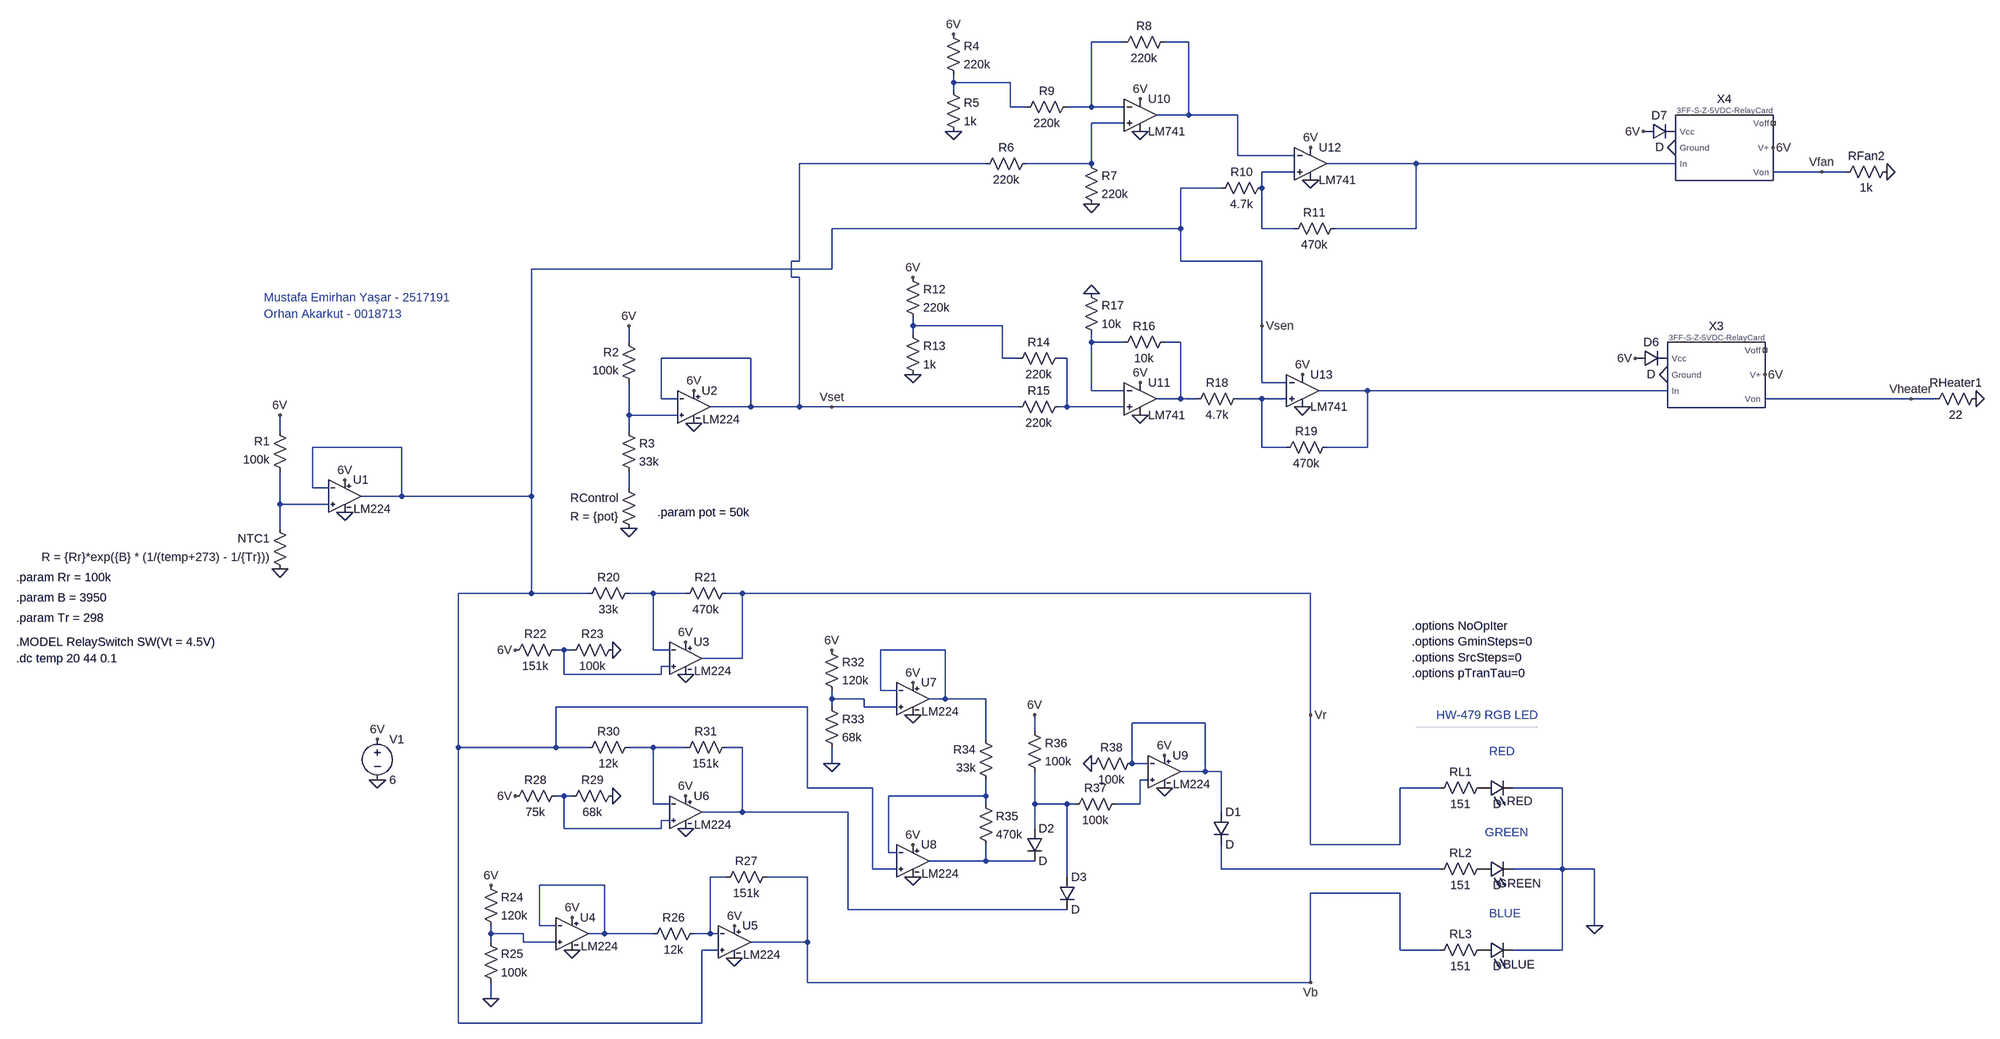
[diagram p0: schematic Completed_Circuit.asc]
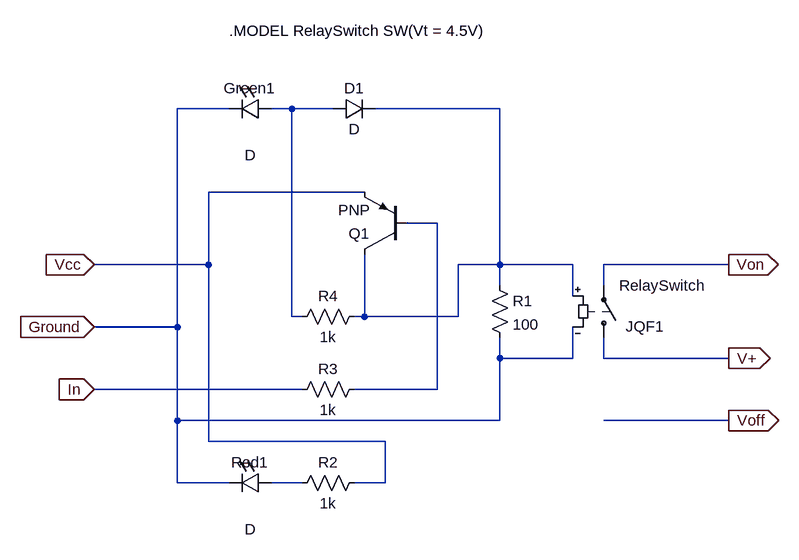
[diagram p1: sub-circuit 3ff-s-z-5vdc-relaycard.asc]
Completed_Circuit.asc, the LTspice schematic file:
Version 4
SHEET 1 2996 820
WIRE 1040 -1504 976 -1504
WIRE 1168 -1504 1120 -1504
WIRE 704 -1424 704 -1440
WIRE 816 -1424 704 -1424
WIRE 704 -1408 704 -1424
WIRE 816 -1376 816 -1424
WIRE 848 -1376 816 -1376
WIRE 976 -1376 976 -1504
WIRE 976 -1376 928 -1376
WIRE 1040 -1376 976 -1376
WIRE 1168 -1360 1168 -1504
WIRE 1168 -1360 1104 -1360
WIRE 1264 -1360 1168 -1360
WIRE 1040 -1344 976 -1344
WIRE 1264 -1280 1264 -1360
WIRE 1376 -1280 1264 -1280
WIRE 768 -1264 400 -1264
WIRE 976 -1264 976 -1344
WIRE 976 -1264 848 -1264
WIRE 1616 -1264 1440 -1264
WIRE 2128 -1264 1616 -1264
WIRE 1376 -1248 1312 -1248
WIRE 2416 -1248 2320 -1248
WIRE 2464 -1248 2416 -1248
WIRE 1232 -1216 1152 -1216
WIRE 1312 -1216 1312 -1248
WIRE 1152 -1136 1152 -1216
WIRE 1152 -1136 464 -1136
WIRE 1312 -1136 1312 -1216
WIRE 1376 -1136 1312 -1136
WIRE 1616 -1136 1616 -1264
WIRE 1616 -1136 1456 -1136
WIRE 400 -1072 400 -1264
WIRE 400 -1072 384 -1072
WIRE 1152 -1072 1152 -1136
WIRE 1312 -1072 1152 -1072
WIRE 464 -1056 464 -1136
WIRE 464 -1056 -128 -1056
WIRE 384 -1040 384 -1072
WIRE 400 -1040 384 -1040
WIRE 624 -944 624 -960
WIRE 800 -944 624 -944
WIRE 1312 -944 1312 -1072
WIRE 624 -928 624 -944
WIRE 64 -912 64 -944
WIRE 976 -912 976 -928
WIRE 1040 -912 976 -912
WIRE 1152 -912 1120 -912
WIRE 304 -880 128 -880
WIRE 800 -880 800 -944
WIRE 832 -880 800 -880
WIRE 928 -880 912 -880
WIRE 1312 -832 1312 -944
WIRE 1360 -832 1312 -832
WIRE 976 -816 976 -912
WIRE 1040 -816 976 -816
WIRE 1520 -816 1424 -816
WIRE 2112 -816 1520 -816
WIRE 128 -800 128 -880
WIRE 160 -800 128 -800
WIRE 1152 -800 1152 -912
WIRE 1152 -800 1104 -800
WIRE 1184 -800 1152 -800
WIRE 1312 -800 1264 -800
WIRE 1360 -800 1312 -800
WIRE 2592 -800 2304 -800
WIRE 2640 -800 2592 -800
WIRE 304 -784 304 -880
WIRE 304 -784 224 -784
WIRE 400 -784 400 -1040
WIRE 400 -784 304 -784
WIRE 464 -784 400 -784
WIRE 832 -784 464 -784
WIRE 928 -784 928 -880
WIRE 928 -784 912 -784
WIRE 1040 -784 928 -784
WIRE 64 -768 64 -832
WIRE 160 -768 64 -768
WIRE -624 -736 -624 -768
WIRE 64 -736 64 -768
WIRE -384 -704 -560 -704
WIRE 1312 -704 1312 -800
WIRE 1360 -704 1312 -704
WIRE 1520 -704 1520 -816
WIRE 1520 -704 1440 -704
WIRE -560 -624 -560 -704
WIRE -528 -624 -560 -624
WIRE 64 -624 64 -656
WIRE -384 -608 -384 -704
WIRE -384 -608 -464 -608
WIRE -128 -608 -128 -1056
WIRE -128 -608 -384 -608
WIRE -624 -592 -624 -656
WIRE -528 -592 -624 -592
WIRE -624 -544 -624 -592
WIRE -128 -416 -128 -608
WIRE -128 -416 -272 -416
WIRE -16 -416 -128 -416
WIRE 112 -416 64 -416
WIRE 176 -416 112 -416
WIRE 288 -416 256 -416
WIRE 1408 -416 288 -416
WIRE -64 -304 -80 -304
WIRE -48 -304 -64 -304
WIRE 112 -304 112 -416
WIRE 144 -304 112 -304
WIRE 688 -304 560 -304
WIRE 288 -288 288 -416
WIRE 288 -288 208 -288
WIRE 144 -272 128 -272
WIRE -64 -256 -64 -304
WIRE 128 -256 128 -272
WIRE 128 -256 -64 -256
WIRE 560 -224 560 -304
WIRE 592 -224 560 -224
WIRE 464 -208 464 -224
WIRE 528 -208 464 -208
WIRE 688 -208 688 -304
WIRE 688 -208 656 -208
WIRE 768 -208 688 -208
WIRE 416 -192 -80 -192
WIRE 464 -192 464 -208
WIRE 528 -192 528 -208
WIRE 592 -192 528 -192
WIRE 1408 -176 1408 -416
WIRE 1200 -160 1056 -160
WIRE 864 -144 864 -176
WIRE 768 -128 768 -208
WIRE -272 -112 -272 -416
WIRE -80 -112 -80 -192
WIRE -80 -112 -272 -112
WIRE -16 -112 -80 -112
WIRE 112 -112 64 -112
WIRE 176 -112 112 -112
WIRE 288 -112 256 -112
WIRE 464 -80 464 -112
WIRE 1056 -80 1056 -160
WIRE 1088 -80 1056 -80
WIRE 1200 -64 1200 -160
WIRE 1200 -64 1152 -64
WIRE 1232 -64 1200 -64
WIRE 1088 -48 1072 -48
WIRE 416 -32 416 -192
WIRE 544 -32 416 -32
WIRE 1664 -32 1584 -32
WIRE 1904 -32 1808 -32
WIRE -64 -16 -80 -16
WIRE -48 -16 -64 -16
WIRE 768 -16 768 -48
WIRE 768 -16 576 -16
WIRE 112 0 112 -112
WIRE 144 0 112 0
WIRE 768 0 768 -16
WIRE 864 0 864 -64
WIRE 928 0 864 0
WIRE 944 0 928 0
WIRE 1072 0 1072 -48
WIRE 1072 0 1024 0
WIRE 288 16 288 -112
WIRE 288 16 208 16
WIRE 496 16 288 16
WIRE 1232 16 1232 -64
WIRE 144 32 128 32
WIRE -64 48 -64 -16
WIRE 128 48 128 32
WIRE 128 48 -64 48
WIRE 864 48 864 0
WIRE 1408 80 1408 -176
WIRE 1584 80 1584 -32
WIRE 1584 80 1408 80
WIRE 576 96 576 -16
WIRE 592 96 576 96
WIRE 768 112 768 80
WIRE 768 112 656 112
WIRE 864 112 768 112
WIRE 544 128 544 -32
WIRE 592 128 544 128
WIRE 1232 128 1232 80
WIRE 1664 128 1232 128
WIRE 1904 128 1904 -32
WIRE 1904 128 1808 128
WIRE 1968 128 1904 128
WIRE 256 144 224 144
WIRE 416 144 336 144
WIRE 928 144 928 0
WIRE 16 160 -112 160
WIRE 1584 176 1408 176
WIRE 496 208 496 16
WIRE 928 208 496 208
WIRE -112 240 -112 160
WIRE -80 240 -112 240
WIRE 1968 240 1968 128
WIRE -208 256 -208 240
WIRE -144 256 -208 256
WIRE 16 256 16 160
WIRE 16 256 -16 256
WIRE 112 256 16 256
WIRE 224 256 224 144
WIRE 224 256 192 256
WIRE 240 256 224 256
WIRE -208 272 -208 256
WIRE -144 272 -144 256
WIRE -80 272 -144 272
WIRE 416 272 416 144
WIRE 416 272 304 272
WIRE 240 288 208 288
WIRE 1584 288 1584 176
WIRE 1664 288 1584 288
WIRE 1904 288 1904 128
WIRE 1904 288 1808 288
WIRE 416 352 416 272
WIRE 1408 352 1408 176
WIRE 1408 352 416 352
WIRE -208 384 -208 352
WIRE -272 432 -272 -112
WIRE 208 432 208 288
WIRE 208 432 -272 432
FLAG -432 -48 0
FLAG -432 -128 6V
FLAG -208 160 6V
FLAG 1968 240 0
FLAG -208 384 0
FLAG 32 -304 0
FLAG -160 -304 6V
FLAG 1408 -176 Vr
FLAG 1408 352 Vb
FLAG 464 -304 6V
FLAG 464 -80 0
FLAG 32 -16 0
FLAG -160 -16 6V
FLAG 976 -80 0
FLAG -624 -768 6V
FLAG -624 -464 0
FLAG 64 -944 6V
FLAG 64 -544 0
FLAG 464 -784 Vset
FLAG -496 -640 6V
FLAG -496 -576 0
FLAG 176 -16 6V
FLAG 176 -320 6V
FLAG -48 224 6V
FLAG 272 240 6V
FLAG 624 -240 6V
FLAG 624 80 6V
FLAG 1120 -96 6V
FLAG 176 -256 0
FLAG 176 48 0
FLAG -48 288 0
FLAG 272 304 0
FLAG 624 144 0
FLAG 624 -176 0
FLAG 1120 -32 0
FLAG 864 -176 6V
FLAG 192 -816 6V
FLAG 192 -752 0
FLAG 1312 -944 Vsen
FLAG 1392 -848 6V
FLAG 1408 -1296 6V
FLAG 1408 -1232 0
FLAG 2720 -800 0
FLAG 2544 -1248 0
FLAG 2128 -1296 0
FLAG 2064 -1328 6V
FLAG 2320 -1296 6V
FLAG 2416 -1248 Vfan
FLAG 2592 -800 Vheater
FLAG 2048 -880 6V
FLAG 1392 -784 0
FLAG 2112 -848 0
FLAG 2304 -848 6V
FLAG 624 -848 0
FLAG 624 -1040 6V
FLAG 1072 -832 6V
FLAG 1072 -768 0
FLAG 976 -1008 0
FLAG 704 -1328 0
FLAG 704 -1520 6V
FLAG 1072 -1392 6V
FLAG 1072 -1328 0
FLAG 976 -1184 0
SYMBOL OpAmps\\LM224 -48 192 R0
SYMATTR InstName U4
SYMBOL voltage -432 -144 R0
WINDOW 123 0 0 Left 0
WINDOW 39 0 0 Left 0
SYMATTR InstName V1
SYMATTR Value 6
SYMBOL res -224 144 R0
SYMATTR InstName R24
SYMATTR Value 120k
SYMBOL res -224 256 R0
SYMATTR InstName R25
SYMATTR Value 100k
SYMBOL OpAmps\\LM224 272 208 R0
SYMATTR InstName U5
SYMBOL res 208 240 R90
WINDOW 0 0 56 VBottom 2
WINDOW 3 32 56 VTop 2
SYMATTR InstName R26
SYMATTR Value 12k
SYMBOL res 352 128 R90
WINDOW 0 0 56 VBottom 2
WINDOW 3 32 56 VTop 2
SYMATTR InstName R27
SYMATTR Value 151k
SYMBOL OpAmps\\LM224 176 -352 R0
SYMATTR InstName U3
SYMBOL res 80 -432 R90
WINDOW 0 0 56 VBottom 2
WINDOW 3 32 56 VTop 2
SYMATTR InstName R20
SYMATTR Value 33k
SYMBOL res 272 -432 R90
WINDOW 0 0 56 VBottom 2
WINDOW 3 32 56 VTop 2
SYMATTR InstName R21
SYMATTR Value 470k
SYMBOL LED 1744 -16 R270
WINDOW 0 -26 76 VTop 2
WINDOW 3 0 32 VBottom 2
SYMATTR InstName RED
SYMBOL LED 1744 144 R270
WINDOW 0 -28 75 VTop 2
WINDOW 3 0 32 VBottom 2
SYMATTR InstName GREEN
SYMBOL LED 1744 304 R270
WINDOW 0 -28 75 VTop 2
WINDOW 3 0 32 VBottom 2
SYMATTR InstName BLUE
SYMBOL res 1760 -48 R90
WINDOW 0 0 56 VBottom 2
WINDOW 3 32 56 VTop 2
SYMATTR InstName RL1
SYMATTR Value 151
SYMBOL res 1760 112 R90
WINDOW 0 0 56 VBottom 2
WINDOW 3 32 56 VTop 2
SYMATTR InstName RL2
SYMATTR Value 151
SYMBOL res 1760 272 R90
WINDOW 0 0 56 VBottom 2
WINDOW 3 32 56 VTop 2
SYMATTR InstName RL3
SYMATTR Value 151
SYMBOL res -64 -320 R90
WINDOW 0 0 56 VBottom 2
WINDOW 3 32 56 VTop 2
SYMATTR InstName R22
SYMATTR Value 151k
SYMBOL res 48 -320 R90
WINDOW 0 0 56 VBottom 2
WINDOW 3 32 56 VTop 2
SYMATTR InstName R23
SYMATTR Value 100k
SYMBOL OpAmps\\LM224 624 -272 R0
SYMATTR InstName U7
SYMBOL res 448 -320 R0
SYMATTR InstName R32
SYMATTR Value 120k
SYMBOL res 448 -208 R0
SYMATTR InstName R33
SYMATTR Value 68k
SYMBOL OpAmps\\LM224 624 48 R0
SYMATTR InstName U8
SYMBOL res 784 -32 R180
WINDOW 0 36 76 Left 2
WINDOW 3 36 40 Left 2
SYMATTR InstName R34
SYMATTR Value 33k
SYMBOL res 752 -16 R0
SYMATTR InstName R35
SYMATTR Value 470k
SYMBOL OpAmps\\LM224 176 -48 R0
SYMATTR InstName U6
SYMBOL res 80 -128 R90
WINDOW 0 0 56 VBottom 2
WINDOW 3 32 56 VTop 2
SYMATTR InstName R30
SYMATTR Value 12k
SYMBOL res 272 -128 R90
WINDOW 0 0 56 VBottom 2
WINDOW 3 32 56 VTop 2
SYMATTR InstName R31
SYMATTR Value 151k
SYMBOL res -64 -32 R90
WINDOW 0 0 56 VBottom 2
WINDOW 3 32 56 VTop 2
SYMATTR InstName R28
SYMATTR Value 75k
SYMBOL res 48 -32 R90
WINDOW 0 0 56 VBottom 2
WINDOW 3 32 56 VTop 2
SYMATTR InstName R29
SYMATTR Value 68k
SYMBOL OpAmps\\LM224 1120 -128 R0
SYMATTR InstName U9
SYMBOL res 1072 -96 R90
WINDOW 0 0 56 VBottom 2
WINDOW 3 32 56 VTop 2
SYMATTR InstName R38
SYMATTR Value 100k
SYMBOL diode 1216 16 R0
SYMATTR InstName D1
SYMBOL diode 848 48 R0
SYMATTR InstName D2
SYMBOL diode 912 144 R0
SYMATTR InstName D3
SYMBOL res 848 -160 R0
SYMATTR InstName R36
SYMATTR Value 100k
SYMBOL res 1040 -16 R90
WINDOW 0 0 56 VBottom 2
WINDOW 3 32 56 VTop 2
SYMATTR InstName R37
SYMATTR Value 100k
SYMBOL OpAmps\\LM224 -496 -672 R0
SYMATTR InstName U1
SYMBOL res -608 -640 R180
WINDOW 0 36 76 Left 2
WINDOW 3 36 40 Left 2
SYMATTR InstName R1
SYMATTR Value 100k
SYMBOL res -608 -448 R180
WINDOW 0 36 76 Left 2
WINDOW 3 36 40 Left 2
SYMATTR InstName NTC1
SYMATTR Value R = {Rr}*exp({B} * (1/(temp+273) - 1/{Tr}))
SYMBOL OpAmps\\LM224 192 -848 R0
SYMATTR InstName U2
SYMBOL res 80 -816 R180
WINDOW 0 36 76 Left 2
WINDOW 3 36 40 Left 2
SYMATTR InstName R2
SYMATTR Value 100k
SYMBOL res 80 -528 R180
WINDOW 0 36 76 Left 2
WINDOW 3 36 40 Left 2
SYMATTR InstName RControl
SYMATTR Value R = {pot}
SYMBOL res 48 -752 R0
SYMATTR InstName R3
SYMATTR Value 33k
SYMBOL OpAmps\\LM741 1392 -880 R0
SYMATTR InstName U13
SYMBOL OpAmps\\LM741 1408 -1328 R0
SYMATTR InstName U12
SYMBOL res 2736 -816 R90
WINDOW 0 0 56 VBottom 2
WINDOW 3 32 56 VTop 2
SYMATTR InstName RHeater1
SYMATTR Value 22
SYMBOL res 2560 -1264 R90
WINDOW 0 0 56 VBottom 2
WINDOW 3 32 56 VTop 2
SYMATTR InstName RFan2
SYMATTR Value 1k
SYMBOL Switches\\3FF-S-Z-5VDC-RelayCard 2208 -848 R0
SYMATTR InstName X3
SYMBOL Switches\\3FF-S-Z-5VDC-RelayCard 2224 -1296 R0
SYMATTR InstName X4
SYMBOL diode 2048 -864 R270
WINDOW 0 32 32 VTop 2
WINDOW 3 0 32 VBottom 2
SYMATTR InstName D6
SYMBOL diode 2064 -1312 R270
WINDOW 0 32 32 VTop 2
WINDOW 3 0 32 VBottom 2
SYMATTR InstName D7
SYMBOL res 608 -1056 R0
SYMATTR InstName R12
SYMATTR Value 220k
SYMBOL res 608 -944 R0
SYMATTR InstName R13
SYMATTR Value 1k
SYMBOL res 928 -800 R90
WINDOW 0 0 56 VBottom 2
WINDOW 3 32 56 VTop 2
SYMATTR InstName R15
SYMATTR Value 220k
SYMBOL OpAmps\\LM741 1072 -864 R0
SYMATTR InstName U11
SYMBOL res 928 -896 R90
WINDOW 0 0 56 VBottom 2
WINDOW 3 32 56 VTop 2
SYMATTR InstName R14
SYMATTR Value 220k
SYMBOL res 1136 -928 R90
WINDOW 0 0 56 VBottom 2
WINDOW 3 32 56 VTop 2
SYMATTR InstName R16
SYMATTR Value 10k
SYMBOL res 960 -1024 R0
SYMATTR InstName R17
SYMATTR Value 10k
SYMBOL res 1472 -1152 R90
WINDOW 0 0 56 VBottom 2
WINDOW 3 32 56 VTop 2
SYMATTR InstName R11
SYMATTR Value 470k
SYMBOL res 1328 -1232 R90
WINDOW 0 0 56 VBottom 2
WINDOW 3 32 56 VTop 2
SYMATTR InstName R10
SYMATTR Value 4.7k
SYMBOL res 1456 -720 R90
WINDOW 0 0 56 VBottom 2
WINDOW 3 32 56 VTop 2
SYMATTR InstName R19
SYMATTR Value 470k
SYMBOL res 1280 -816 R90
WINDOW 0 0 56 VBottom 2
WINDOW 3 32 56 VTop 2
SYMATTR InstName R18
SYMATTR Value 4.7k
SYMBOL res 688 -1536 R0
SYMATTR InstName R4
SYMATTR Value 220k
SYMBOL res 688 -1424 R0
SYMATTR InstName R5
SYMATTR Value 1k
SYMBOL res 864 -1280 R90
WINDOW 0 0 56 VBottom 2
WINDOW 3 32 56 VTop 2
SYMATTR InstName R6
SYMATTR Value 220k
SYMBOL OpAmps\\LM741 1072 -1424 R0
SYMATTR InstName U10
SYMBOL res 960 -1280 R0
SYMATTR InstName R7
SYMATTR Value 220k
SYMBOL res 1136 -1520 R90
WINDOW 0 0 56 VBottom 2
WINDOW 3 32 56 VTop 2
SYMATTR InstName R8
SYMATTR Value 220k
SYMBOL res 944 -1392 R90
WINDOW 0 0 56 VBottom 2
WINDOW 3 32 56 VTop 2
SYMATTR InstName R9
SYMATTR Value 220k
TEXT -656 -1000 Left 2 ;Mustafa Emirhan Yaşar - 2517191
TEXT -656 -968 Left 2 ;Orhan Akarkut - 0018713
TEXT 1760 -104 Left 2 ;RED
TEXT 1752 56 Left 2 ;GREEN
TEXT 1760 216 Left 2 ;BLUE
TEXT 1656 -176 Left 2 ;HW-479 RGB LED
TEXT 1616 -152 Left 0 ;------------------------------------------------------------------------
TEXT 1608 -352 Left 2 !.options NoOpIter\n.options GminSteps=0\n.options SrcSteps=0\n.options pTranTau=0
TEXT -1144 -448 Left 2 !.param Rr = 100k
TEXT -1144 -408 Left 2 !.param B = 3950
TEXT -1144 -368 Left 2 !.param Tr = 298
TEXT -1144 -288 Left 2 !.dc temp 20 44 0.1
TEXT 120 -576 Left 2 !.param pot = 50k
TEXT -1144 -320 Left 2 !.MODEL RelaySwitch SW(Vt = 4.5V)

3ff-s-z-5vdc-relaycard.asc, the sub-circuit schematic file:
Version 4
SHEET 1 916 680
WIRE 16 -128 -64 -128
WIRE 112 -128 80 -128
WIRE 176 -128 112 -128
WIRE 432 -128 240 -128
WIRE 224 0 -16 0
WIRE 336 48 288 48
WIRE -16 112 -16 0
WIRE -16 112 -192 112
WIRE 432 112 432 -128
WIRE 432 112 368 112
WIRE 544 112 432 112
WIRE 784 112 592 112
WIRE 432 144 432 112
WIRE 592 144 592 112
WIRE 544 160 544 112
WIRE 112 192 112 -128
WIRE 128 192 112 192
WIRE 224 192 224 96
WIRE 224 192 208 192
WIRE 368 192 368 112
WIRE 368 192 224 192
WIRE -64 208 -64 -128
WIRE -64 208 -192 208
WIRE 432 256 432 224
WIRE 544 256 544 208
WIRE 544 256 432 256
WIRE 592 256 592 224
WIRE 784 256 592 256
WIRE 128 304 -192 304
WIRE 336 304 336 48
WIRE 336 304 208 304
WIRE -64 352 -64 208
WIRE 432 352 432 256
WIRE 432 352 -64 352
WIRE 784 352 592 352
WIRE -16 384 -16 112
WIRE 256 384 -16 384
WIRE -64 448 -64 352
WIRE 16 448 -64 448
WIRE 128 448 80 448
WIRE 256 448 256 384
WIRE 256 448 208 448
FLAG -192 304 In
IOPIN -192 304 In
FLAG -192 208 Ground
IOPIN -192 208 In
FLAG -192 112 Vcc
IOPIN -192 112 In
FLAG 784 256 V+
IOPIN 784 256 Out
FLAG 784 112 Von
IOPIN 784 112 Out
FLAG 784 352 Voff
IOPIN 784 352 Out
SYMBOL sw 592 240 M180
WINDOW 0 34 33 Left 2
SYMATTR InstName JQF1
SYMATTR Value RelaySwitch
SYMBOL res 416 128 R0
SYMATTR InstName R1
SYMATTR Value 100
SYMBOL LED 80 -144 R90
WINDOW 0 0 32 VBottom 2
WINDOW 3 72 32 VTop 2
SYMATTR InstName Green1
SYMBOL diode 176 -112 R270
WINDOW 0 32 32 VTop 2
WINDOW 3 0 32 VBottom 2
SYMATTR InstName D1
SYMBOL LED 80 432 R90
WINDOW 0 0 32 VBottom 2
WINDOW 3 72 32 VTop 2
SYMATTR InstName Red1
SYMBOL res 112 464 R270
WINDOW 0 32 56 VTop 2
WINDOW 3 0 56 VBottom 2
SYMATTR InstName R2
SYMATTR Value 1k
SYMBOL res 112 320 R270
WINDOW 0 32 56 VTop 2
WINDOW 3 0 56 VBottom 2
SYMATTR InstName R3
SYMATTR Value 1k
SYMBOL pnp 288 96 R180
SYMATTR InstName Q1
SYMBOL res 112 208 R270
WINDOW 0 32 56 VTop 2
WINDOW 3 0 56 VBottom 2
SYMATTR InstName R4
SYMATTR Value 1k
TEXT 16 -248 Left 2 !.MODEL RelaySwitch SW(Vt = 4.5V)

The netlist it stands for:
* Completed_Circuit.asc
XU4 N031 N030 6V 0 N030 LM224  ; pins In+ In- V+ V- OUT
V1 6V 0 6
R24 6V N031 120k
R25 N031 0 100k
XU5 Vsen N029 6V 0 Vb LM224  ; pins In+ In- V+ V- OUT
R26 N029 N030 12k
R27 Vb N029 151k
XU3 N017 N016 6V 0 Vr LM224  ; pins In+ In- V+ V- OUT
R20 N016 Vsen 33k
R21 Vr N016 470k
D§RED P001 0 D
D§GREEN P002 0 D
D§BLUE P003 0 D
RL1 P001 Vr 151
RL2 P002 N028 151
RL3 P003 Vb 151
R22 N017 6V 151k
R23 0 N017 100k
XU7 N019 N018 6V 0 N018 LM224  ; pins In+ In- V+ V- OUT
R32 6V N019 120k
R33 N019 0 68k
XU8 Vsen N025 6V 0 N027 LM224  ; pins In+ In- V+ V- OUT
R34 N025 N018 33k
R35 N025 N027 470k
XU6 N024 N021 6V 0 N022 LM224  ; pins In+ In- V+ V- OUT
R30 N021 Vsen 12k
R31 N022 N021 151k
R28 N024 6V 75k
R29 0 N024 68k
XU9 N023 N020 6V 0 N020 LM224  ; pins In+ In- V+ V- OUT
R38 N020 0 100k
D1 N020 N028 D
D2 N026 N027 D
D3 N026 N022 D
R36 6V N026 100k
R37 N023 N026 100k
XU1 N015 Vsen 6V 0 Vsen LM224  ; pins In+ In- V+ V- OUT
R1 N015 6V 100k
R§NTC1 0 N015 R = {Rr}*exp({B} * (1/(temp+273) - 1/{Tr}))
XU2 N013 Vset 6V 0 Vset LM224  ; pins In+ In- V+ V- OUT
R2 N013 6V 100k
RControl 0 N014 R = {pot}
R3 N013 N014 33k
XU13 N012 Vsen 6V 0 N011 LM741  ; pins In+ In- V+ V- OUT
XU12 N006 N002 6V 0 N005 LM741  ; pins In+ In- V+ V- OUT
RHeater1 0 Vheater 22
RFan2 0 Vfan 1k
XX3 0 N011 P004 6V NC_01 Vheater 3ff-s-z-5vdc-relaycard
XX4 0 N005 P005 6V NC_02 Vfan 3ff-s-z-5vdc-relaycard
D6 6V P004 D
D7 6V P005 D
R12 6V N007 220k
R13 N007 0 1k
R15 N010 Vset 220k
XU11 N010 N008 6V 0 N009 LM741  ; pins In+ In- V+ V- OUT
R14 N010 N007 220k
R16 N009 N008 10k
R17 0 N008 10k
R11 N005 N006 470k
R10 N006 Vsen 4.7k
R19 N011 N012 470k
R18 N012 N009 4.7k
R4 6V N003 220k
R5 N003 0 1k
R6 N004 Vset 220k
XU10 N004 N001 6V 0 N002 LM741  ; pins In+ In- V+ V- OUT
R7 N004 0 220k
R8 N002 N001 220k
R9 N001 N003 220k

* block symbol definitions
.subckt 3ff-s-z-5vdc-relaycard Ground In Vcc V+ Voff Von
S§JQF1 V+ Von N002 Ground RelaySwitch
R1 N002 Ground 100
D§Green1 N001 Ground D
D1 N001 N002 D
D§Red1 N004 Ground D
R2 N004 Vcc 1k
R3 In N003 1k
Q1 N002 N003 Vcc 0 PNP
R4 N001 N002 1k
.MODEL RelaySwitch SW(Vt = 4.5V)
.ends 3ff-s-z-5vdc-relaycard

.model D D
.lib standard.dio
.model NPN NPN
.model PNP PNP
.lib standard.bjt
* Mustafa Emirhan Yaşar - 2517191
* Orhan Akarkut - 0018713
* RED
* GREEN
* BLUE
* HW-479 RGB LED
* ------------------------------------------------------------------------
.options NoOpIter
.options GminSteps=0
.options SrcSteps=0
.options pTranTau=0
.param Rr = 100k
.param B = 3950
.param Tr = 298
.dc temp 20 44 0.1
.param pot = 50k
.MODEL RelaySwitch SW(Vt = 4.5V)
.lib LM224.lib
.lib LM741.lib
.backanno
.end